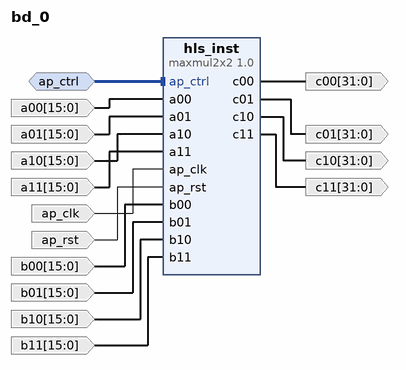
[diagram p0: block diagram of the top level]
# Vivado block design bd_0, xc7a35tcpg236-1, Vivado 2025.1
create_bd_design bd_0

create_bd_intf_port -mode Slave -vlnv xilinx.com:interface:acc_handshake_rtl:1.0 ap_ctrl
create_bd_port -dir I -from 15 -to 0 -type data a00
create_bd_port -dir I -from 15 -to 0 -type data a01
create_bd_port -dir I -from 15 -to 0 -type data a10
create_bd_port -dir I -from 15 -to 0 -type data a11
create_bd_port -dir I -type clk ap_clk
set_property -dict {CONFIG.FREQ_HZ 100000000.0} [get_bd_ports ap_clk]
create_bd_port -dir I -type rst ap_rst
set_property -dict {CONFIG.POLARITY ACTIVE_HIGH} [get_bd_ports ap_rst]
create_bd_port -dir I -from 15 -to 0 -type data b00
create_bd_port -dir I -from 15 -to 0 -type data b01
create_bd_port -dir I -from 15 -to 0 -type data b10
create_bd_port -dir I -from 15 -to 0 -type data b11
create_bd_port -dir O -from 31 -to 0 -type data c00
create_bd_port -dir O -from 31 -to 0 -type data c01
create_bd_port -dir O -from 31 -to 0 -type data c10
create_bd_port -dir O -from 31 -to 0 -type data c11

create_bd_cell -type ip -vlnv xilinx.com:hls:maxmul2x2:1.0 hls_inst

# ---- connections ----

connect_bd_intf_net -intf_net ap_ctrl_0_1 [get_bd_intf_ports ap_ctrl] [get_bd_intf_pins hls_inst/ap_ctrl]
connect_bd_net -net a00_0_1 [get_bd_ports a00] [get_bd_pins hls_inst/a00]
connect_bd_net -net a01_0_1 [get_bd_ports a01] [get_bd_pins hls_inst/a01]
connect_bd_net -net a10_0_1 [get_bd_ports a10] [get_bd_pins hls_inst/a10]
connect_bd_net -net a11_0_1 [get_bd_ports a11] [get_bd_pins hls_inst/a11]
connect_bd_net -net ap_clk_0_1 [get_bd_ports ap_clk] [get_bd_pins hls_inst/ap_clk]
connect_bd_net -net ap_rst_0_1 [get_bd_ports ap_rst] [get_bd_pins hls_inst/ap_rst]
connect_bd_net -net b00_0_1 [get_bd_ports b00] [get_bd_pins hls_inst/b00]
connect_bd_net -net b01_0_1 [get_bd_ports b01] [get_bd_pins hls_inst/b01]
connect_bd_net -net b10_0_1 [get_bd_ports b10] [get_bd_pins hls_inst/b10]
connect_bd_net -net b11_0_1 [get_bd_ports b11] [get_bd_pins hls_inst/b11]
connect_bd_net [get_bd_pins hls_inst/c00] [get_bd_ports c00]
connect_bd_net [get_bd_pins hls_inst/c01] [get_bd_ports c01]
connect_bd_net [get_bd_pins hls_inst/c10] [get_bd_ports c10]
connect_bd_net [get_bd_pins hls_inst/c11] [get_bd_ports c11]

validate_bd_design
save_bd_design
